# EAGLE design caretaker-switch8 (EAGLE 6.5.0)

## Sheet 1 of 2
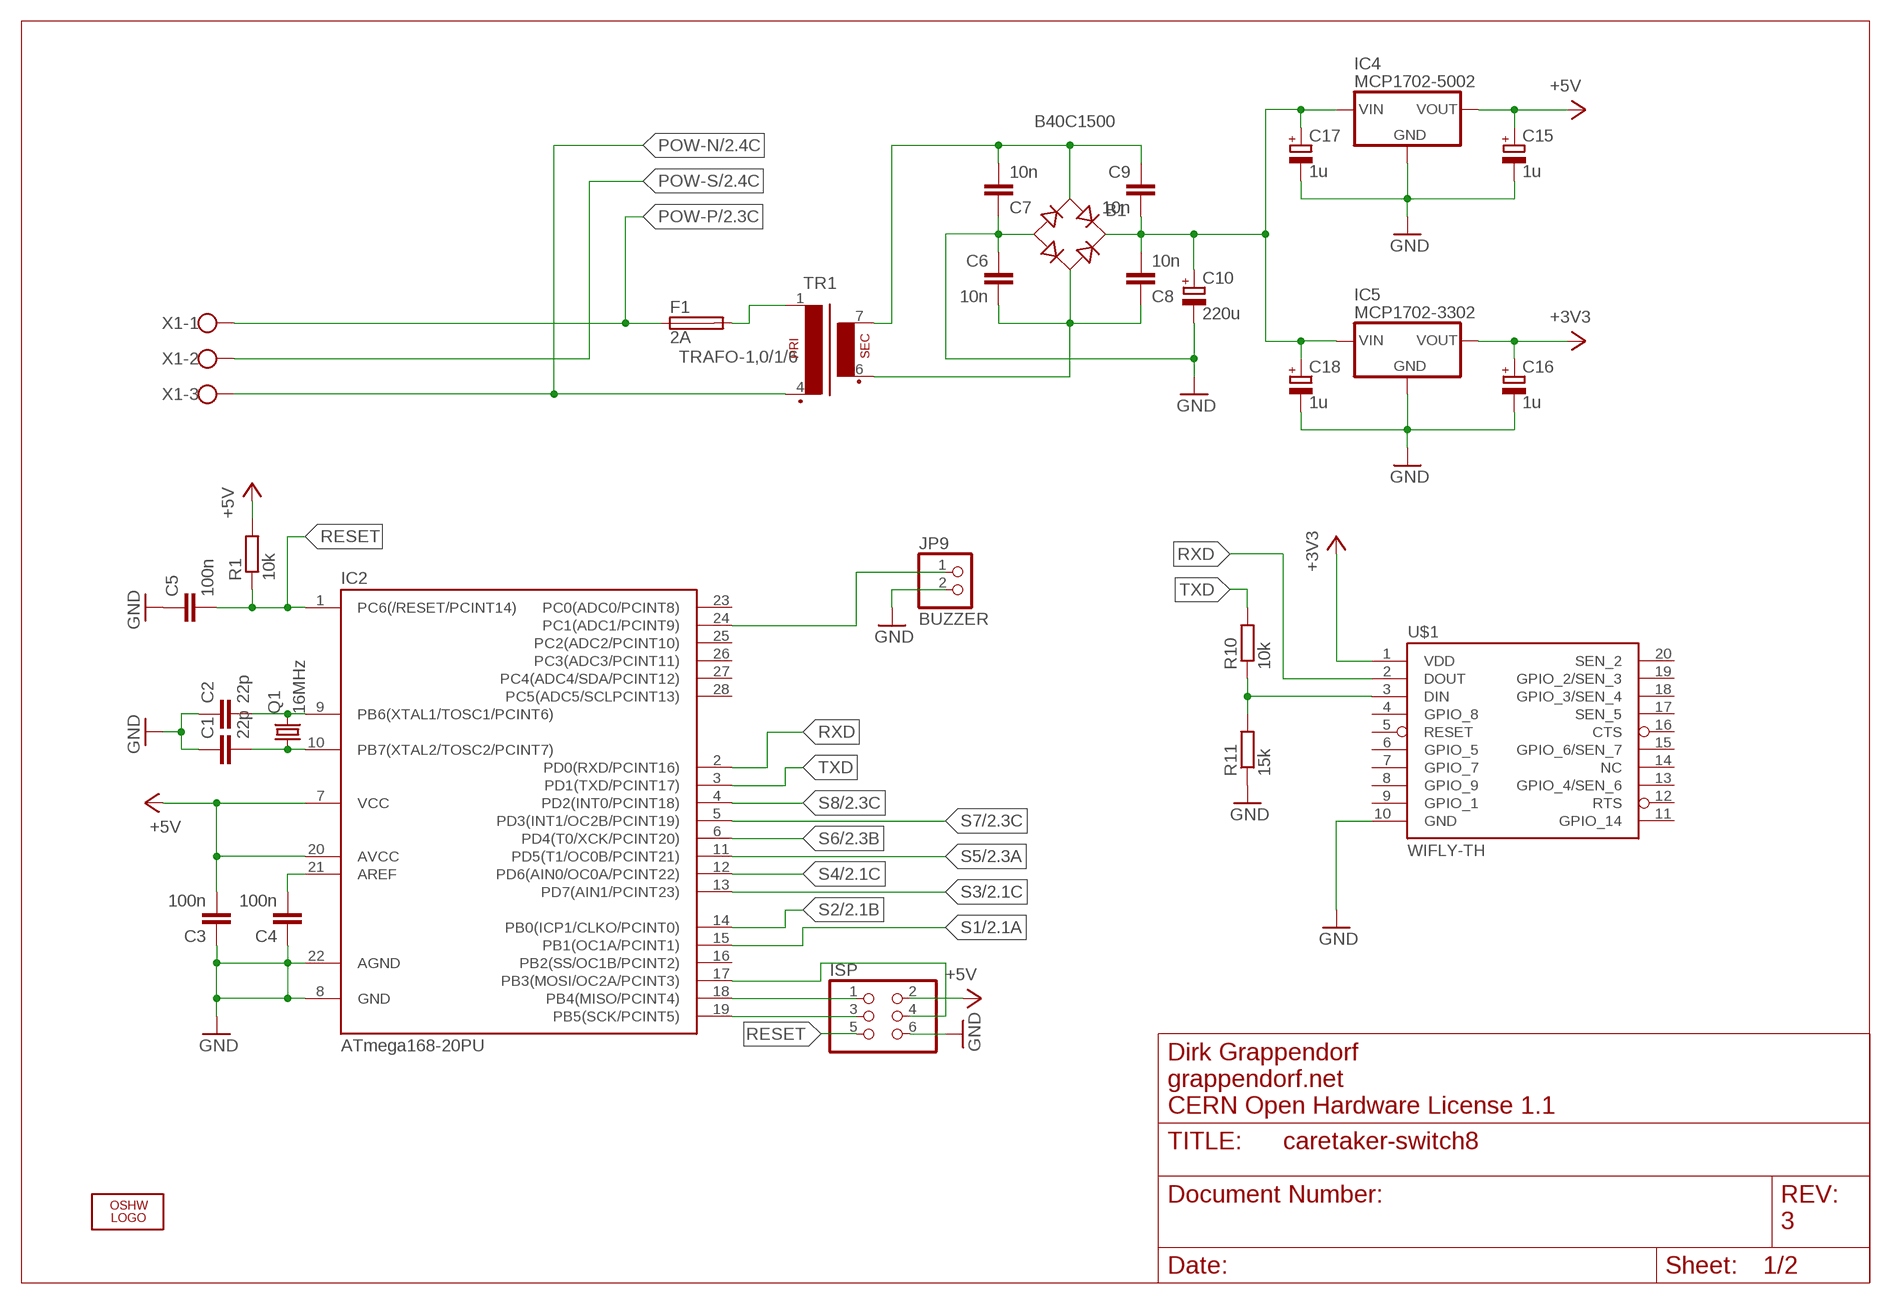
[diagram p0: schematic, sheet 1]

### Parts
B1  B40C1500  RECTIFIER-2KBB  [2KBB]
C1  22p  C-EU025-025X050  [C025-025X050]
C2  22p  C-EU025-025X050  [C025-025X050]
C3  100n  C-EU025-024X044  [C025-024X044]
C4  100n  C-EU025-024X044  [C025-024X044]
C5  100n  C-EU025-024X044  [C025-024X044]
C6  10n  C-EU025-024X044  [C025-024X044]
C7  10n  C-EU025-024X044  [C025-024X044]
C8  10n  C-EU025-024X044  [C025-024X044]
C9  10n  C-EU025-024X044  [C025-024X044]
C10  220u  CPOL-EUE3.5-8  [E3,5-8]
C15  1u  CPOL-EUE2.5-5  [E2,5-5]
C16  1u  CPOL-EUE2.5-5  [E2,5-5]
C17  1u  CPOL-EUE2.5-5  [E2,5-5]
C18  1u  CPOL-EUE2.5-5  [E2,5-5]
F1  2A  SH22,5  [SH22,5]
IC2  ATmega168-20PU  ATMEGA48/88/168-PU  [DIL28-3]
IC4  MCP1702-5002  MCP1702  [MCP1702]
IC5  MCP1702-3302  MCP1702  [MCP1702]
ISP  PINHD-2X3  [2X03]
JP9  BUZZER  PINHD-1X2  [1X02]
LOGO1  OSHW_LOGO_10MILX0350-NT-BOTTOM  [OSHW_10X350_NOTEXT_BOTTOM]
Q1  16MHz  CRYSTALHC49U-V  [HC49U-V]
R1  10k  R-EU_0204/7  [0204/7]
R10  10k  R-EU_0204/7  [0204/7]
R11  15k  R-EU_0204/7  [0204/7]
TR1  TRAFO-1,0/1/6  [TRAFO-1,0/1/6]
U$1  WIFLY-TH  [WIFLY-TH]
X1  W237-103  [W237-103]

### Nets
+3V3: C16.+ IC5.VOUT(OUT) U$1.1(VDD)
+5V: C3.2 C15.+ IC2.7(VCC) IC2.20(AVCC) IC4.VOUT(OUT) ISP.2 R1.2
GND: B1.- C1.1 C2.1 C3.1 C4.1 C5.1 C6.1 C7.1 C10.- C15.- C16.- C17.- C18.- IC2.8(GND) IC2.22(AGND) IC4.GND IC5.GND ISP.6 JP9.2 R11.1 U$1.10(GND) ; also sheet 2
N$1: C2.2 IC2.9(PB6(XTAL1/TOSC1/PCINT6)) Q1.2
N$2: C1.2 IC2.10(PB7(XTAL2/TOSC2/PCINT7)) Q1.1
N$3: C4.2 IC2.21(AREF)
N$4: IC2.18(PB4(MISO/PCINT4)) ISP.1
N$5: IC2.24(PC1(ADC1/PCINT9)) JP9.1
N$6: IC2.19(PB5(SCK/PCINT5)) ISP.3
N$12: B1.AC1 C7.2 C9.1 TR1.7(S4)
N$14: B1.+ C8.2 C9.2 C10.+ C17.+ C18.+ IC4.VIN(IN) IC5.VIN(IN)
N$22: IC2.17(PB3(MOSI/OC2A/PCINT3)) ISP.4
N$42: F1.2 TR1.1
N$49: R10.1 R11.2 U$1.3(DIN)
N$50: B1.AC2 C6.2 C8.1 TR1.6(S3)
POW-N: TR1.4(P2) X1.3 ; also sheet 2
POW-P: F1.1 X1.1 ; also sheet 2
POW-S: X1.2 ; also sheet 2
RESET: C5.2 IC2.1(PC6(/RESET/PCINT14)) ISP.5 R1.1
RXD: IC2.2(PD0(RXD/PCINT16)) U$1.2(DOUT)
S1: IC2.15(PB1(OC1A/PCINT1)) ; also sheet 2
S2: IC2.14(PB0(ICP1/CLKO/PCINT0)) ; also sheet 2
S3: IC2.13(PD7(AIN1/PCINT23)) ; also sheet 2
S4: IC2.12(PD6(AIN0/OC0A/PCINT22)) ; also sheet 2
S5: IC2.11(PD5(T1/OC0B/PCINT21)) ; also sheet 2
S6: IC2.6(PD4(T0/XCK/PCINT20)) ; also sheet 2
S7: IC2.5(PD3(INT1/OC2B/PCINT19)) ; also sheet 2
S8: IC2.4(PD2(INT0/PCINT18)) ; also sheet 2
TXD: IC2.3(PD1(TXD/PCINT17)) R10.2
Unconnected: IC2.16(PB2(SS/OC1B/PCINT2)) IC2.23(PC0(ADC0/PCINT8)) IC2.25(PC2(ADC2/PCINT10)) IC2.26(PC3(ADC3/PCINT11)) IC2.27(PC4(ADC4/SDA/PCINT12)) IC2.28(PC5(ADC5/SCLPCINT13)) U$1.4(GPIO_8) U$1.5(RESET) U$1.6(GPIO_5) U$1.7(GPIO_7) U$1.8(GPIO_9) U$1.9(GPIO_1) U$1.11(GPIO_14) U$1.12(RTS) U$1.13(GPIO_4/SEN_6) U$1.14(NC) U$1.15(GPIO_6/SEN_7) U$1.16(CTS) U$1.17(SEN_5) U$1.18(GPIO_3/SEN_4) U$1.19(GPIO_2/SEN_3) U$1.20(SEN_2)

### Notes on the sheet
- Dirk Grappendorf
- grappendorf.net
- CERN Open Hardware License 1.1
- 3

## Sheet 2 of 2
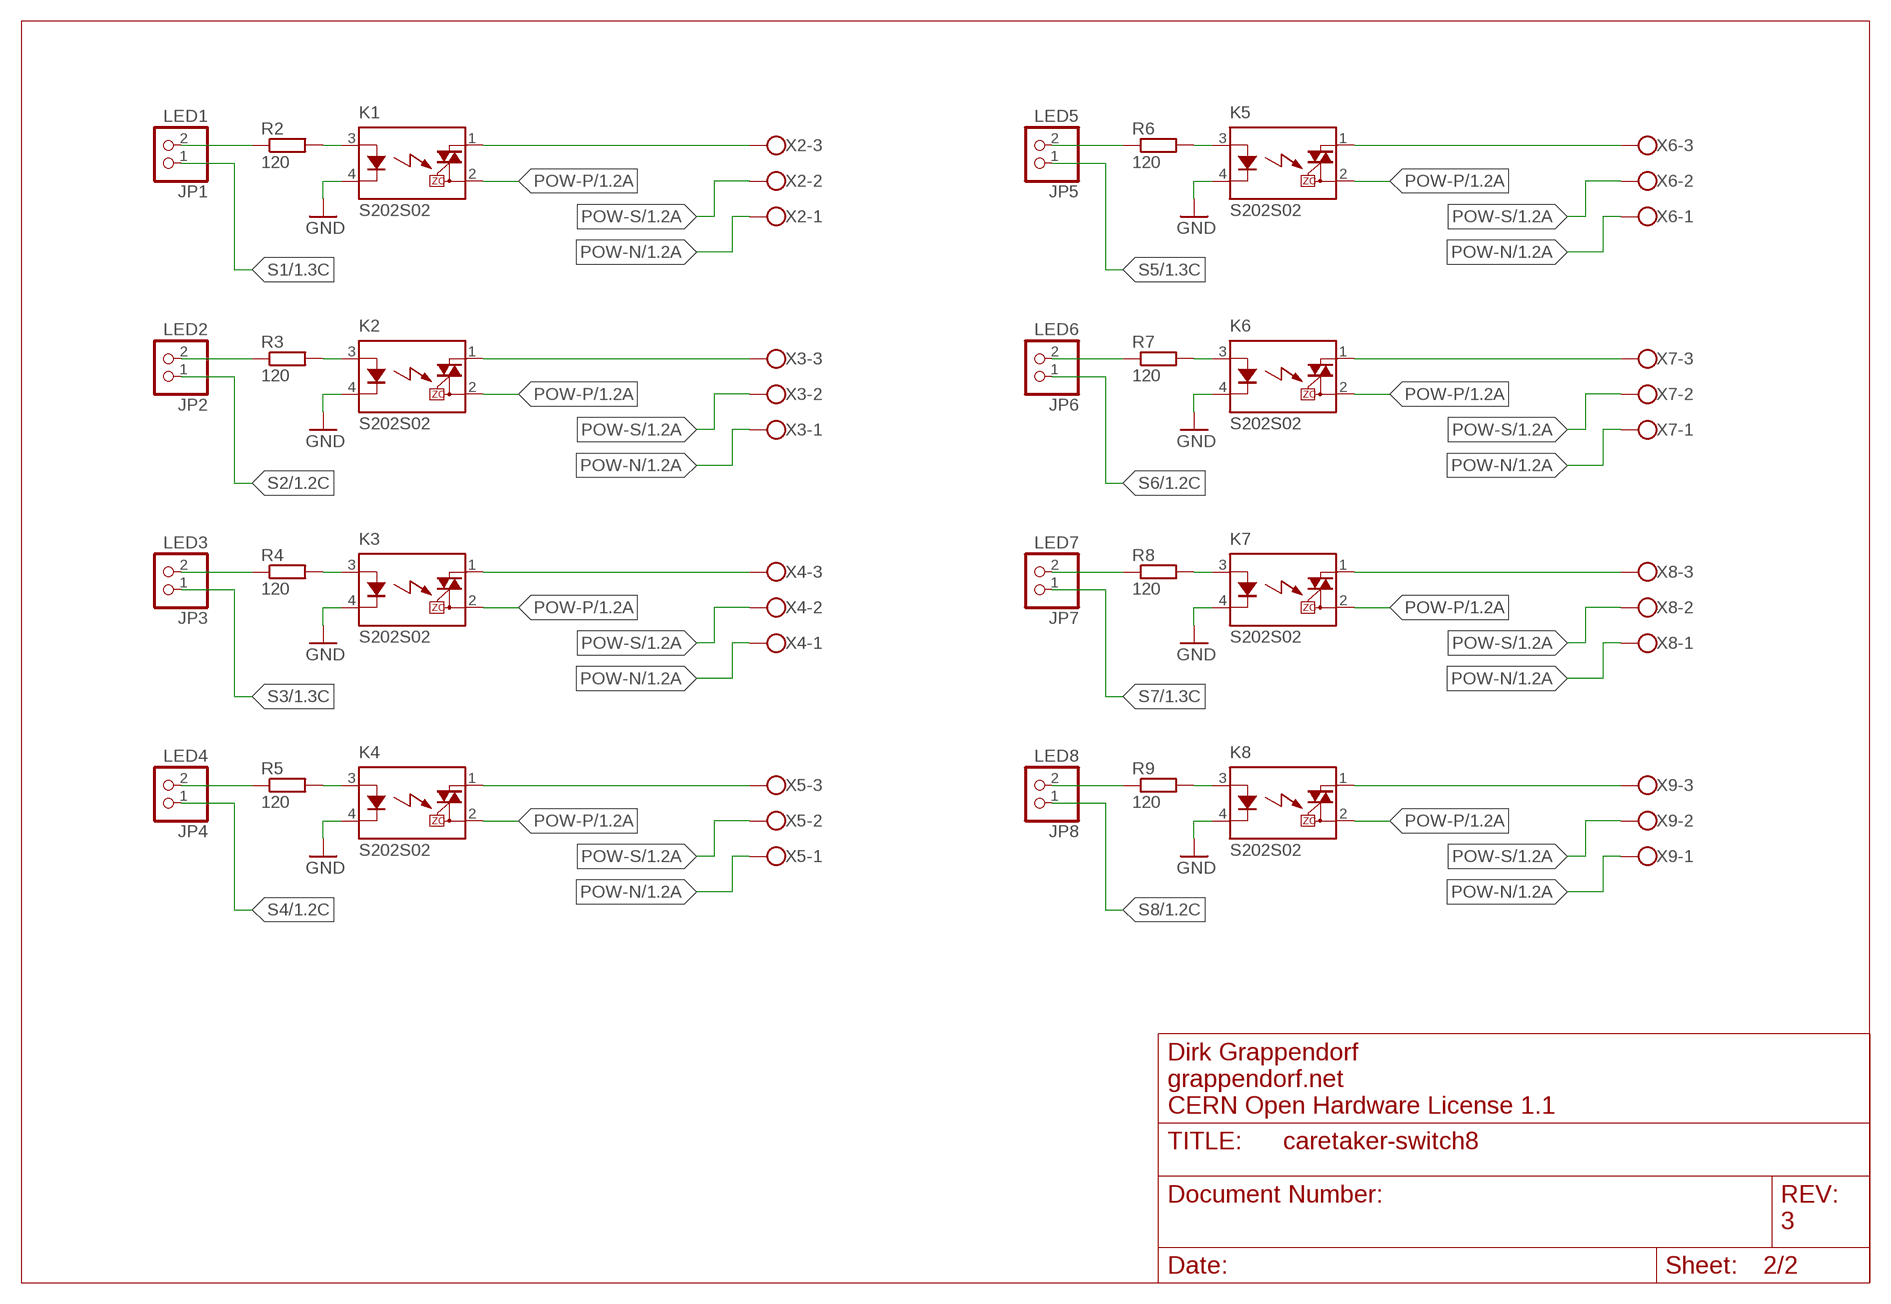
[diagram p1: schematic, sheet 2]

### Parts
JP1  LED1  PINHD-1X2  [1X02]
JP2  LED2  PINHD-1X2  [1X02]
JP3  LED3  PINHD-1X2  [1X02]
JP4  LED4  PINHD-1X2  [1X02]
JP5  LED5  PINHD-1X2  [1X02]
JP6  LED6  PINHD-1X2  [1X02]
JP7  LED7  PINHD-1X2  [1X02]
JP8  LED8  PINHD-1X2  [1X02]
K1  S202S02  [S202S02]
K2  S202S02  [S202S02]
K3  S202S02  [S202S02]
K4  S202S02  [S202S02]
K5  S202S02  [S202S02]
K6  S202S02  [S202S02]
K7  S202S02  [S202S02]
K8  S202S02  [S202S02]
R2  120  R-EU_0204/7  [0204/7]
R3  120  R-EU_0204/7  [0204/7]
R4  120  R-EU_0204/7  [0204/7]
R5  120  R-EU_0204/7  [0204/7]
R6  120  R-EU_0204/7  [0204/7]
R7  120  R-EU_0204/7  [0204/7]
R8  120  R-EU_0204/7  [0204/7]
R9  120  R-EU_0204/7  [0204/7]
X2  W237-103  [W237-103]
X3  W237-103  [W237-103]
X4  W237-103  [W237-103]
X5  W237-103  [W237-103]
X6  W237-103  [W237-103]
X7  W237-103  [W237-103]
X8  W237-103  [W237-103]
X9  W237-103  [W237-103]

### Nets
GND: K1.4(K) K2.4(K) K3.4(K) K4.4(K) K5.4(K) K6.4(K) K7.4(K) K8.4(K) ; also sheet 1
N$7: K1.1(DS1) X2.3
N$9: K2.1(DS1) X3.3
N$10: K3.1(DS1) X4.3
N$11: K4.1(DS1) X5.3
N$13: K5.1(DS1) X6.3
N$15: K6.1(DS1) X7.3
N$16: K7.1(DS1) X8.3
N$17: K8.1(DS1) X9.3
N$18: JP1.2 R2.1
N$19: K1.3(A) R2.2
N$20: JP2.2 R3.1
N$21: K2.3(A) R3.2
N$23: JP3.2 R4.1
N$24: K3.3(A) R4.2
N$29: JP4.2 R5.1
N$30: K4.3(A) R5.2
N$31: JP5.2 R6.1
N$32: K5.3(A) R6.2
N$33: JP6.2 R7.1
N$34: K6.3(A) R7.2
N$35: JP7.2 R8.1
N$36: K7.3(A) R8.2
N$37: JP8.2 R9.1
N$38: K8.3(A) R9.2
POW-N: X2.1 X3.1 X4.1 X5.1 X6.1 X7.1 X8.1 X9.1 ; also sheet 1
POW-P: K1.2(DS2) K2.2(DS2) K3.2(DS2) K4.2(DS2) K5.2(DS2) K6.2(DS2) K7.2(DS2) K8.2(DS2) ; also sheet 1
POW-S: X2.2 X3.2 X4.2 X5.2 X6.2 X7.2 X8.2 X9.2 ; also sheet 1
S1: JP1.1 ; also sheet 1
S2: JP2.1 ; also sheet 1
S3: JP3.1 ; also sheet 1
S4: JP4.1 ; also sheet 1
S5: JP5.1 ; also sheet 1
S6: JP6.1 ; also sheet 1
S7: JP7.1 ; also sheet 1
S8: JP8.1 ; also sheet 1

### Notes on the sheet
- Dirk Grappendorf
- grappendorf.net
- CERN Open Hardware License 1.1
- 3

## Library data of the parts
B1 = rectifier:RECTIFIER-: Rectifier
C1-C9 = rcl:C-EU: CAPACITOR, European symbol
C10 C15-C18 = rcl:CPOL-EU: POLARIZED CAPACITOR, European symbol
F1 = fuse:SH22,5: FUSE HOLDER grid 22,5 mm, OGN0031 8201, Schurter (Buerklin)
IC2 = atmega8:ATMEGA48/88/168-PU
IC4 IC5 = grapelabs:MCP1702: VOLTAGE REGULATOR
ISP = pinhead:PINHD-2X3: PIN HEADER
JP1-JP9 = pinhead:PINHD-1X2: PIN HEADER
K1-K8 = relay:S*02S02: IT(rms) 8A, Zero Cross type SIP 4pin Triac output SSR Source: http://sharp-world.com/products/device/lineup/data/pdf/datasheet/s102s02_e.pdf
LOGO1 = OSHW:OSHW_LOGO_10MIL
Q1 = crystal:CRYSTAL: CRYSTAL
R1-R11 = rcl:R-EU_: RESISTOR, European symbol
TR1 = grapelabs:TRAFO-1,0/1/6: TRANSFORMER 1 primary winding, 1 secondary winding BLOCK
U$1 = grapelabs:WIFLY
X1-X9 = con-wago-500:W237-103: WAGO SCREW CLAMP

## Board
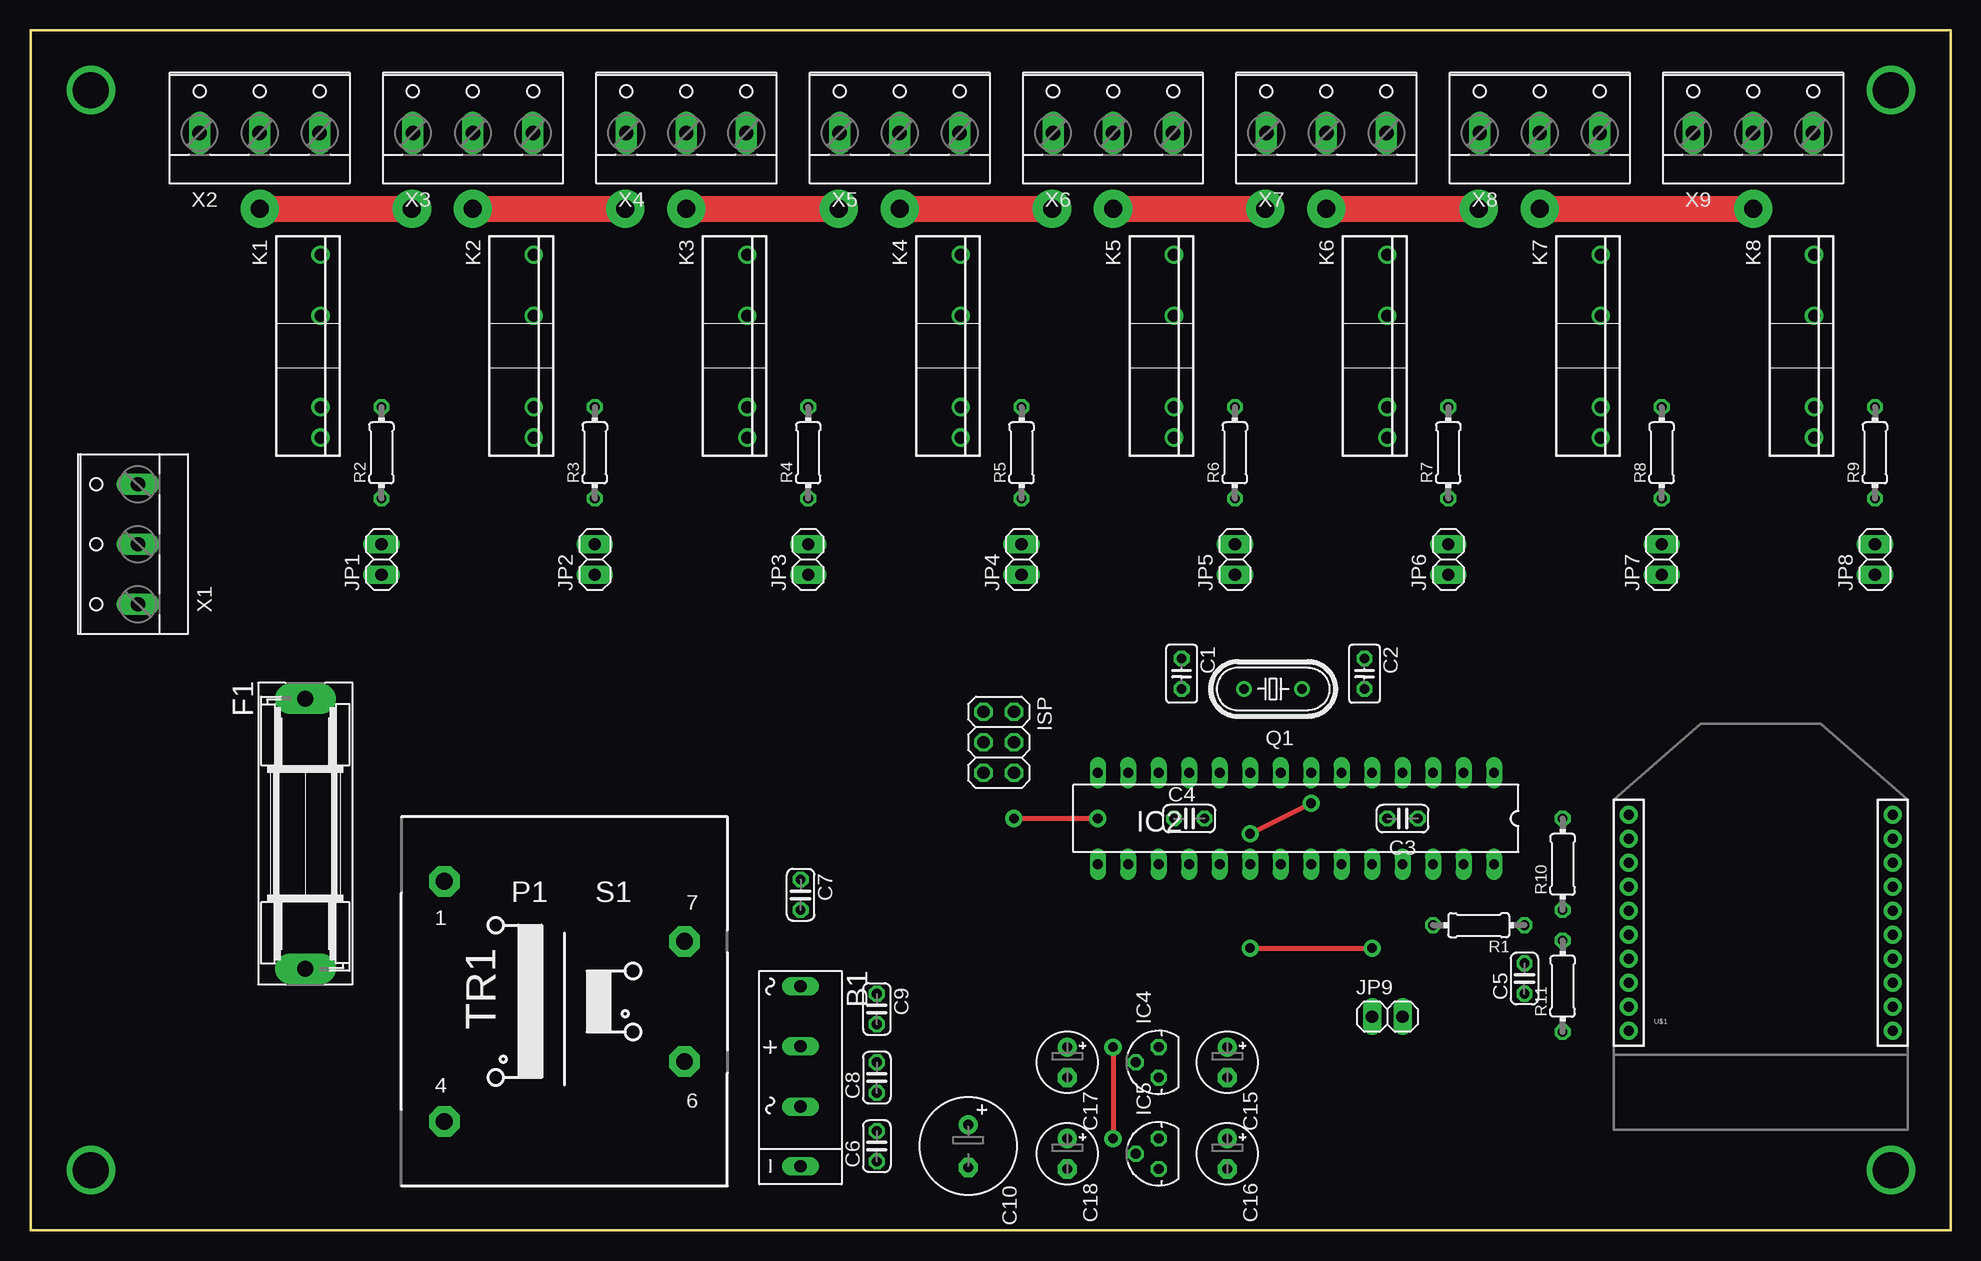
[diagram p2: board, top side]
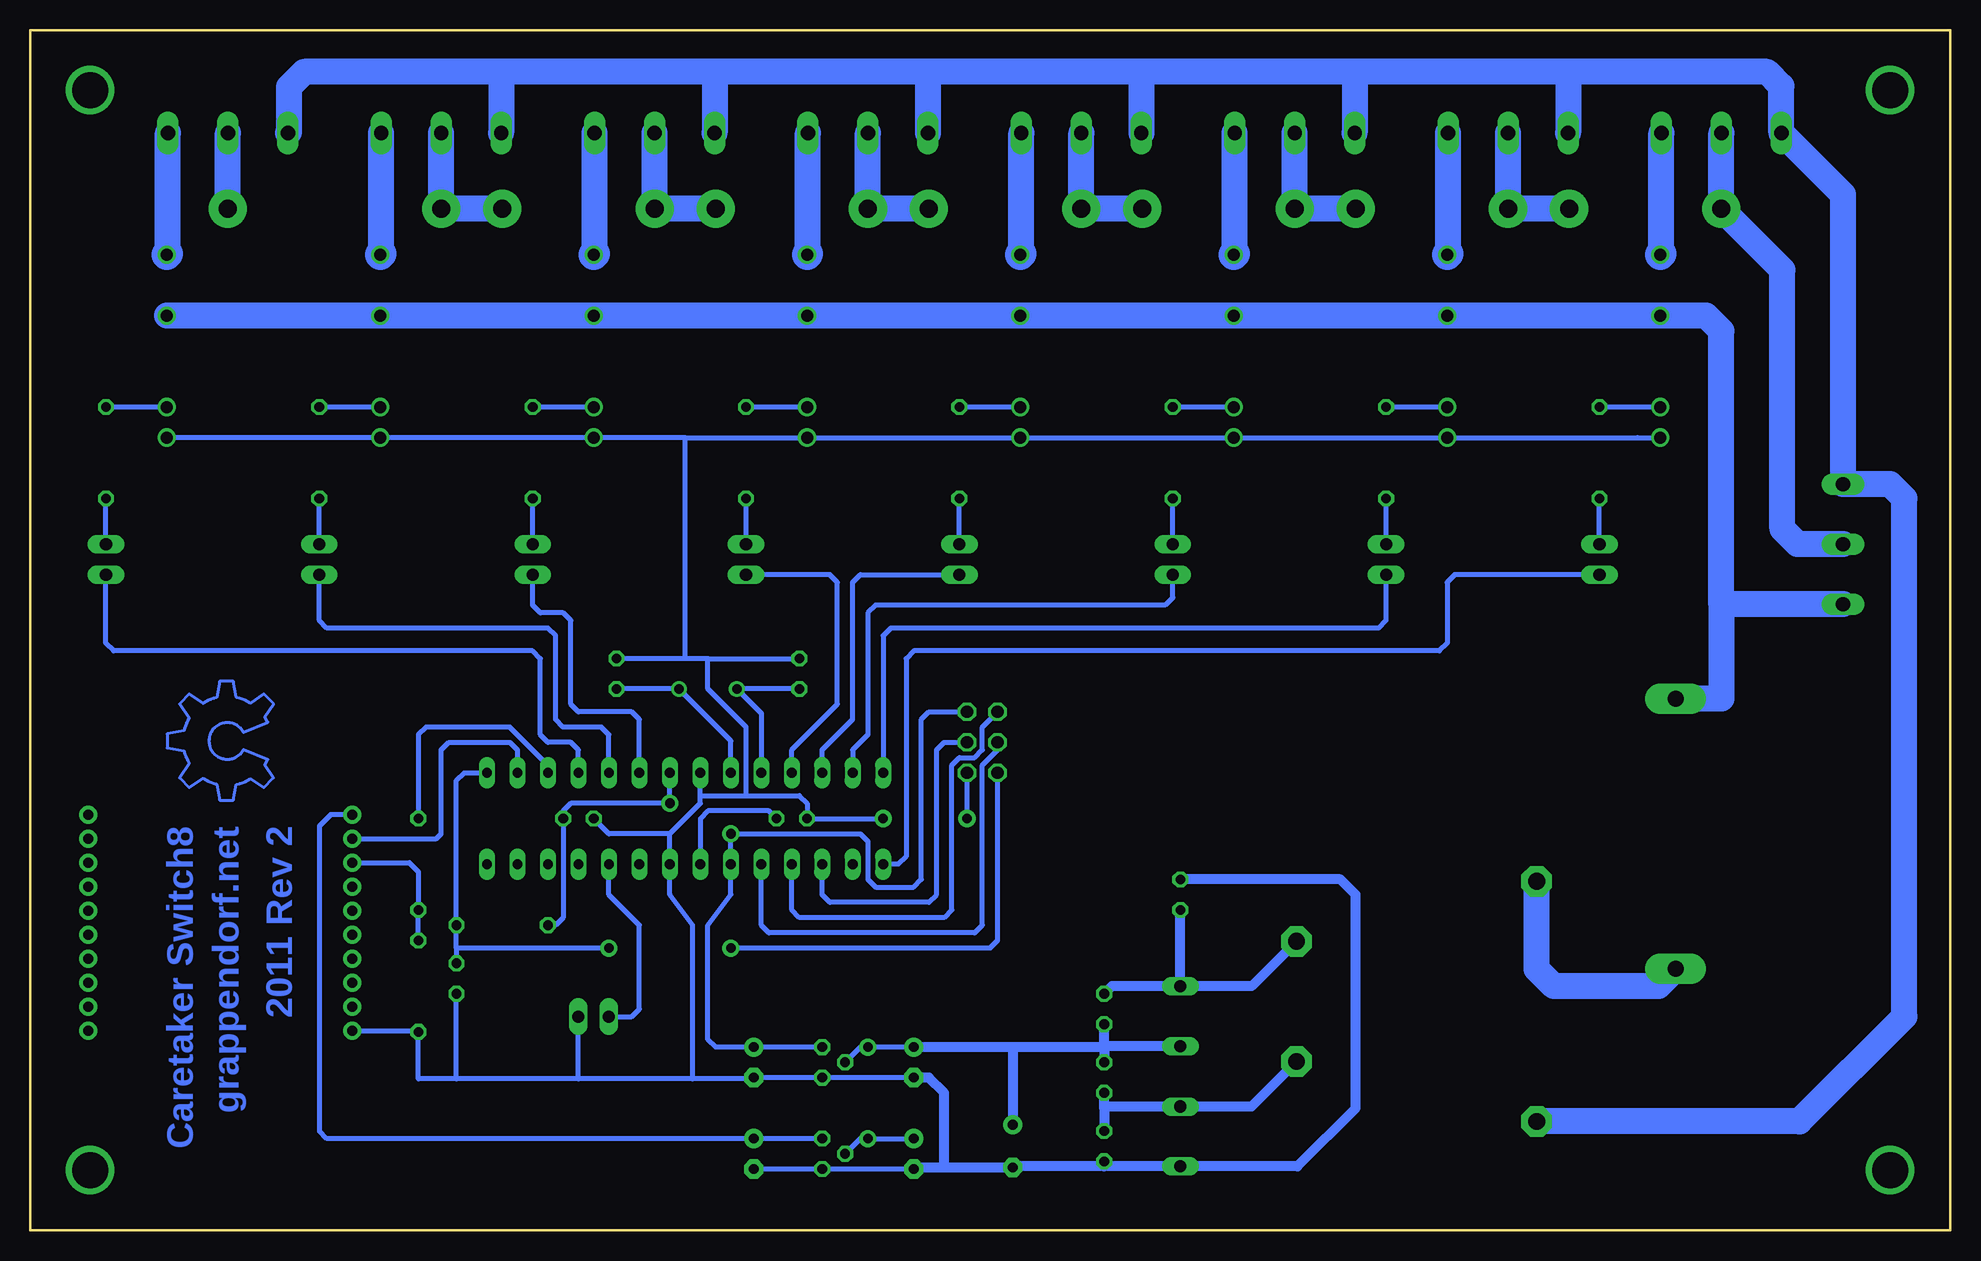
[diagram p3: board, bottom side, seen from below]

Size 160 x 100 mm. Coordinates in mm from the lower left corner, seen from the top.
Outline: 0,0 160,0 160,100 0,100 0,0
Copper layers (1*16): Top 0.035mm / dielectric 1.5mm / Bottom 0.035mm
Design rules "default": minimum track width 10mil, minimum drill 24mil, track to track 8mil, track to pad 8mil, pad to pad 8mil, via to via 8mil, smd to smd 8mil, copper to edge 40mil, drill to drill 8mil, minimum pad ring 10mil, minimum via ring 8mil, stop-mask expansion 4mil, vias tented up to drill 0mil, thermal gap 10mil

### Footprints (pad centres in the part's own frame; a part is rotated, then mirrored left to right if it is on the bottom)
2KBB = drill 1.016 long: + -2.616,0; - 7.391,0; AC1 -7.62,0; AC2 2.413,0
C025-025X050 = drill 0.813 octagon: 1 -1.27,0; 2 1.27,0
C025-024X044 = drill 0.813 octagon: 1 -1.27,0; 2 1.27,0
E3,5-8 = drill 0.813 pad 1.6: + -1.778,0 | drill 0.813 pad 1.6 octagon: - 1.778,0
E2,5-5 = drill 0.813 pad 1.6: + -1.27,0 | drill 0.813 pad 1.6 octagon: - 1.27,0
SH22,5 = drill 1.321 pad 2.54 long: 1 -11.252,0; 2 11.252,0
DIL28-3 = drill 0.813 long: 1 -16.51,-3.81; 2 -13.97,-3.81; 3 -11.43,-3.81; 4 -8.89,-3.81; 5 -6.35,-3.81; 6 -3.81,-3.81; 7 -1.27,-3.81; 8 1.27,-3.81; 9 3.81,-3.81; 10 6.35,-3.81; 11 8.89,-3.81; 12 11.43,-3.81; 13 13.97,-3.81; 14 16.51,-3.81; 15 16.51,3.81; 16 13.97,3.81; 17 11.43,3.81; 18 8.89,3.81; 19 6.35,3.81; 20 3.81,3.81; 21 1.27,3.81; 22 -1.27,3.81; 23 -3.81,3.81; 24 -6.35,3.81; 25 -8.89,3.81; 26 -11.43,3.81; 27 -13.97,3.81; 28 -16.51,3.81
MCP1702 = drill 0.813 octagon: GND -1.27,0; VIN 0,1.905; VOUT 1.27,0
2X03 = drill 1.016 octagon: 1 -2.54,-1.27; 2 -2.54,1.27; 3 0,-1.27; 4 0,1.27; 5 2.54,-1.27; 6 2.54,1.27
1X02 = drill 1.016 long: 1 -1.27,0; 2 1.27,0
S202S02 = drill 1: 1 -7.62,0; 2 -2.54,0; 3 5.08,0; 4 7.62,0
HC49U-V = drill 0.813: 1 -2.413,0; 2 2.413,0
0204/7 = drill 0.813 octagon: 1 -3.81,0; 2 3.81,0
TRAFO-1,0/1/6 = drill 1.397 pad 2.54 octagon: 1 -10.008,10.008; 4 -10.008,-10.008; 6 10.008,-5.004; 7 10.008,5.004
WIFLY-TH = drill 0.8 pad 1.524: 1 -11,20; 2 -11,18; 3 -11,16; 4 -11,14; 5 -11,12; 6 -11,10; 7 -11,8; 8 -11,6; 9 -11,4; 10 -11,2; 11 11,2; 12 11,4; 13 11,6; 14 11,8; 15 11,10; 16 11,12; 17 11,14; 18 11,16; 19 11,18; 20 11,20
W237-103 = drill 1.194 long: 1 -5,-1.29; 2 0,-1.29; 3 5,-1.29

### Placement (x,y rotation side)
B1  64.14,12.7 270 top
C1  95.89,46.35 270 top
C2  111.12,46.35 270 top
C3  114.3,34.29 0 top
C4  96.52,34.29 0 top
C5  124.46,20.95 90 top
C6  70.48,6.99 90 top
C7  64.14,27.94 270 top
C8  70.48,12.7 90 top
C9  70.48,18.41 270 top
C10  78.11,6.99 270 top
C15  99.69,13.97 270 top
C16  99.69,6.35 270 top
C17  86.36,13.97 270 top
C18  86.36,6.35 270 top
F1  22.86,33.02 270 top
IC2  105.41,34.29 180 top
IC4  93.98,13.97 90 top
IC5  93.98,6.35 90 top
ISP  80.64,40.64 270 top
JP1  29.21,55.88 90 top
JP2  46.99,55.88 90 top
JP3  64.77,55.88 90 top
JP4  82.55,55.88 90 top
JP5  100.33,55.88 90 top
JP6  118.11,55.88 90 top
JP7  135.89,55.88 90 top
JP8  153.67,55.88 90 top
JP9  113.03,17.78 0 top
K1  24.13,73.66 270 top
K2  41.91,73.66 270 top
K3  59.69,73.66 270 top
K4  77.47,73.66 270 top
K5  95.25,73.66 270 top
K6  113.03,73.66 270 top
K7  130.81,73.66 270 top
K8  148.59,73.66 270 top
LOGO1  143.51,40.64 270 top
Q1  103.5,45.09 0 top
R1  120.65,25.4 180 top
R2  29.21,64.77 90 top
R3  46.99,64.77 90 top
R4  64.77,64.77 90 top
R5  82.55,64.77 90 top
R6  100.33,64.77 90 top
R7  118.11,64.77 90 top
R8  135.89,64.77 90 top
R9  153.67,64.77 90 top
R10  127.64,30.48 90 top
R11  127.64,20.32 90 top
TR1  44.45,19.05 0 top
U$1  144.15,14.61 0 top
X1  7.62,57.15 90 top
X2  19.05,92.71 0 top
X3  36.83,92.71 0 top
X4  54.61,92.71 0 top
X5  72.39,92.71 0 top
X6  90.17,92.71 0 top
X7  107.95,92.71 0 top
X8  125.73,92.71 0 top
X9  143.51,92.71 0 top

### Tracks (layer width: path | path; a pad name or v marks a point on that pad's centre or on a via)
+3V3
  Bottom 0.406: IC5.VOUT C16.+ 135.25,7.62 135.89,8.26 135.89,33.66 134.94,34.6 U$1.1
+5V  (via drill 0.8 pad 1.42)
  Top 0.406: v101.6,33.02 v106.68,35.56
  Bottom 0.406: IC2.7 v106.68,35.56 114.94,35.56 115.57,34.92 C3.2 115.57,26.04 116.2,25.4 R1.2 | ISP.2 85.09,43.18 85.72,42.55 85.72,29.21 86.36,28.57 89.53,28.57 90.17,29.21 90.17,32.38 90.81,33.02 v101.6,33.02 IC2.20 101.6,27.94 103.5,25.4 103.5,15.88 102.87,15.24 C15.+ IC4.VOUT
GND  (via drill 0.8 pad 1.42)
  Top 0.406: v88.9,34.29 v81.92,34.29
  Bottom 0.406: K1.4 26.04,66.04 K2.4 K3.4 K4.4 K5.4 105.41,66.04 | 105.41,66.04 K6.4 K7.4 K8.4 | 103.5,47.62 C1.1 | 105.41,47.62 C2.1 | 105.41,47.62 105.41,66.04 | 103.5,47.62 105.41,47.62 | 103.5,47.62 103.5,45.09 100.33,41.91 100.33,36.2 | 104.14,36.2 100.33,36.2 | 104.14,36.2 IC2.8 | v88.9,34.29 C4.1 95.25,35.56 95.89,36.2 100.33,36.2 | v81.92,34.29 ISP.6 | C18.- IC5.GND C16.- | C17.- IC4.GND C15.- 99.81,12.59 104.78,12.59 | 104.78,12.59 114.3,12.59 | 114.3,12.59 124.46,12.59 | 124.46,12.59 127.64,12.59 R11.1 127.73,16.61 U$1.10 | 124.46,12.59 C5.1 | 106.68,29.84 106.68,27.94 104.78,25.4 104.78,12.59 | 104.14,36.2 104.14,35.56 106.68,33.02 | IC2.22 106.68,33.02 | 106.68,33.02 111.76,33.02 C3.1 | 114.3,12.59 JP9.2
  Bottom 0.813: 106.68,29.84 IC2.22 | C7.1 50.8,29.21 49.53,27.94 49.53,10.16 54.38,5.31 B1.- 70.48,5.31 | 70.48,5.31 78,5.31 C10.- 83.82,5.21 | 70.48,5.31 C6.1 | 83.82,5.21 86.23,5.21 C18.- | C17.- 85.09,12.7 83.82,11.43 83.82,5.21
N$1
  Bottom 0.406: C2.2 Q1.2 101.6,40.77 IC2.9
N$2
  Bottom 0.406: C1.2 Q1.1 99.06,43.05 IC2.10
N$3
  Bottom 0.406: IC2.21 104.14,34.29 103.5,34.92 98.42,34.92 C4.2
N$4
  Bottom 0.406: IC2.18 96.52,26.67 95.89,26.04 83.82,26.04 83.19,26.67 83.19,38.73 82.55,39.37 81.28,39.37 80.64,40.01 80.64,41.91 ISP.1
N$5
  Bottom 0.406: JP9.1 109.86,17.78 109.22,18.41 109.22,25.4 111.76,27.94 IC2.24
N$6
  Bottom 0.406: ISP.3 79.38,40.01 80.64,38.73 80.64,25.4 81.28,24.77 98.42,24.77 99.06,25.4 IC2.19
N$7
  Bottom 2.184: 24.05,81.36 X2.3
  Bottom 2.54: K1.1 24.05,81.36
N$9
  Bottom 2.184: 41.83,81.36 X3.3
  Bottom 2.54: K2.1 41.83,81.36
N$10
  Bottom 2.184: 59.61,81.36 X4.3
  Bottom 2.54: K3.1 59.61,81.36
N$11
  Bottom 2.184: 77.39,81.36 X5.3
  Bottom 2.54: K4.1 77.39,81.36
N$12
  Bottom 0.813: B1.AC1 58.19,20.32 TR1.7 | B1.AC1 C7.2 | B1.AC1 69.85,20.32 C9.1
N$13
  Bottom 2.184: 95.17,81.36 X6.3
  Bottom 2.54: K5.1 95.17,81.36
N$14  (via drill 0.8 pad 1.42)
  Top 0.406: v90.17,15.24 v90.17,7.62
  Bottom 0.406: C17.+ v90.17,15.24 90.81,15.24 IC4.VIN | C18.+ v90.17,7.62 90.81,7.62 IC5.VIN
  Bottom 0.813: 70.48,15.24 C8.2 | 70.48,15.24 C9.2 | B1.+ 70.41,15.32 70.48,15.24 | 70.48,15.24 78.11,15.24 | 78.11,15.24 C17.+ | 78.11,15.24 C10.+
N$15
  Bottom 2.184: 112.95,81.36 X7.3
  Bottom 2.54: K6.1 112.95,81.36
N$16
  Bottom 2.184: 130.73,81.36 X8.3
  Bottom 2.54: K7.1 130.73,81.36
N$17
  Bottom 2.184: 148.51,81.36 X9.3
  Bottom 2.54: K8.1 148.51,81.36
N$18
  Bottom 0.406: JP1.2 R2.1
N$19
  Bottom 0.406: K1.3 R2.2
N$20
  Bottom 0.406: JP2.2 R3.1
N$21
  Bottom 0.406: K2.3 R3.2
N$22
  Bottom 0.406: IC2.17 93.98,27.94 93.34,27.3 85.09,27.3 84.45,27.94 84.45,40.01 83.82,40.64 ISP.4
N$23
  Bottom 0.406: JP3.2 R4.1
N$24
  Bottom 0.406: K3.3 R4.2
N$25  (via drill 3 pad 2)
  other vias: 5,95
N$26  (via drill 3 pad 2)
  other vias: 155,5
N$27  (via drill 3 pad 2)
  other vias: 5,5
N$28  (via drill 3 pad 2)
  other vias: 155,95
N$29
  Bottom 0.406: JP4.2 R5.1
N$30
  Bottom 0.406: K4.3 R5.2
N$31
  Bottom 0.406: JP5.2 R6.1
N$32
  Bottom 0.406: K5.3 R6.2
N$33
  Bottom 0.406: JP6.2 R7.1
N$34
  Bottom 0.406: K6.3 R7.2
N$35
  Bottom 0.406: JP7.2 R8.1
N$36
  Bottom 0.406: K7.3 R8.2
N$37
  Bottom 0.406: JP8.2 R9.1
N$38
  Bottom 0.406: K8.3 R9.2
N$42
  Bottom 2.184: TR1.1 34.44,21.74 33.02,20.32 24.31,20.32 F1.2
N$43
  Top 0.005: 0.02,-0.05 arc10 0.03,-0.04 | 0.04,-0.03 arc19 0.05,-0.01 | 0.05,0.01 arc19 0.04,0.03 | 0.03,0.04 arc19 0.01,0.05 | -0.03,0.04 arc-19 -0.01,0.05 | -0.05,0.01 arc-19 -0.04,0.03 | -0.04,-0.03 arc-19 -0.05,-0.01 | -0.02,-0.05 arc-10 -0.03,-0.04 | -0.02,0 arc68 -0.01,-0.02 | 0.01,-0.02 arc248 -0.02,0 | 0.02,-0.05 arc10 0.03,-0.04 | 0.03,-0.04 0.05,-0.06 0.06,-0.05 0.04,-0.03 | 0.04,-0.03 arc19 0.05,-0.01 | 0.05,-0.01 0.08,-0.01 0.08,0.01 0.05,0.01 | 0.05,0.01 arc19 0.04,0.03 | 0.04,0.03 0.06,0.05 0.05,0.06 0.03,0.04 | 0.03,0.04 arc19 0.01,0.05 | 0.01,0.05 0.01,0.08 -0.01,0.08 -0.01,0.05 | -0.03,0.04 arc-19 -0.01,0.05 | -0.03,0.04 -0.05,0.06 -0.06,0.05 -0.04,0.03 | -0.05,0.01 arc-19 -0.04,0.03 | -0.05,0.01 -0.08,0.01 -0.08,-0.01 -0.05,-0.01 | -0.04,-0.03 arc-19 -0.05,-0.01 | -0.04,-0.03 -0.06,-0.05 -0.05,-0.06 -0.03,-0.04 | -0.02,-0.05 arc-10 -0.03,-0.04 | -0.01,-0.02 -0.02,-0.05 | -0.02,0 arc68 -0.01,-0.02 | 0.01,-0.02 arc248 -0.02,0 | 0.02,-0.05 0.01,-0.02
N$45  (via drill 1 pad 1.27)
  other vias: 5,95
N$46  (via drill 1 pad 1.27)
  other vias: 155,95
N$47  (via drill 1 pad 1.27)
  other vias: 5,5
N$48  (via drill 1 pad 1.27)
  other vias: 155,5
N$49
  Bottom 0.406: R11.2 R10.1 127.64,29.84 128.4,30.61 U$1.3
N$50
  Bottom 0.813: TR1.6 58.22,10.29 B1.AC2 70.36,10.29 70.48,10.16 | 70.48,10.16 C6.2 | 70.48,10.16 C8.1
POW-N
  Bottom 2.184: 31.75,96.52 15.24,96.52 14.05,95.33 X2.1 8.91,86.28 X1.3 5,62.15 3.81,60.96 3.81,17.78 12.55,9.04 TR1.4 | 31.75,96.52 49.53,96.52 | 49.53,96.52 67.31,96.52 | 67.31,96.52 85.09,96.52 | 85.09,96.52 102.87,96.52 | 102.87,96.52 120.65,96.52 | 120.65,96.52 137.16,96.52 138.43,95.25 138.43,91.5 X9.1 | X3.1 31.83,96.44 31.75,96.52 | X4.1 49.61,96.44 49.53,96.52 | X5.1 67.39,96.44 67.31,96.52 | X6.1 85.17,96.44 85.09,96.52 | X7.1 102.95,96.44 102.87,96.52 | X8.1 120.73,96.44 120.65,96.52
POW-P
  Bottom 2.184: K8.2 K7.2 K6.2 K5.2 K4.2 K3.2 K2.2 K1.2 20.32,76.2 19.05,74.93 19.05,52.07 | F1.1 19.05,44.27 19.05,52.07 | X1.1 18.97,52.15 19.05,52.07
POW-S  (via drill 1.5 pad 3.17)
  Top 2.184: v19.05,85.09 v31.75,85.09 | v36.83,85.09 v49.53,85.09 | v54.61,85.09 v67.31,85.09 | v72.39,85.09 v85.09,85.09 | v90.17,85.09 v102.87,85.09 | v107.95,85.09 v120.65,85.09 | v125.73,85.09 v143.51,85.09
  Bottom 2.184: v143.51,85.09 X9.2 | X8.2 v125.73,85.09 v120.65,85.09 | X7.2 v107.95,85.09 v102.87,85.09 | X6.2 v90.17,85.09 v85.09,85.09 | X5.2 v72.39,85.09 v67.31,85.09 | X4.2 v54.61,85.09 v49.53,85.09 | X3.2 v36.83,85.09 v31.75,85.09 | X2.2 v19.05,85.09 13.97,80.01 13.97,58.42 12.7,57.15 X1.2
RESET  (via drill 0.8 pad 1.42)
  Top 0.406: v101.6,23.5 v111.76,23.5
  Bottom 0.406: IC2.1 123.83,38.1 124.46,37.47 R1.1 124.46,23.5 | 124.46,23.5 C5.2 | ISP.5 79.38,24.13 80.01,23.5 v101.6,23.5 | v111.76,23.5 124.46,23.5
RXD
  Bottom 0.406: IC2.2 119.38,40.01 120.02,40.64 125.09,40.64 125.73,40.01 125.73,33.02 126.14,32.6 U$1.2
S1
  Bottom 0.406: JP1.1 41.27,54.61 41.91,53.98 41.91,48.9 42.55,48.26 86.36,48.26 87,47.62 87,31.11 87.63,30.48 IC2.15
S2
  Bottom 0.406: JP2.1 46.99,50.8 47.62,50.16 88.27,50.16 88.9,49.53 IC2.14
S3
  Bottom 0.406: JP3.1 64.77,52.7 65.41,52.07 89.53,52.07 90.17,51.44 90.17,41.27 91.44,40.01 IC2.13
S4
  Bottom 0.406: IC2.12 93.98,40.01 91.44,42.55 91.44,53.98 90.81,54.61 JP4.1
S5
  Bottom 0.406: IC2.11 96.52,40.01 92.71,43.81 92.71,53.98 93.34,54.61 JP5.1
S6
  Bottom 0.406: JP6.1 118.11,52.07 117.47,51.44 115.57,51.44 114.94,50.8 114.94,43.81 114.3,43.18 109.86,43.18 109.22,42.55 IC2.6
S7
  Bottom 0.406: JP7.1 135.89,50.8 135.25,50.16 116.84,50.16 116.2,49.53 116.2,42.55 115.57,41.91 112.39,41.91 111.76,41.27 IC2.5
S8
  Bottom 0.406: JP8.1 153.67,48.9 153.03,48.26 118.11,48.26 117.47,47.62 117.47,41.27 116.84,40.64 114.94,40.64 114.3,40.01 IC2.4
TXD
  Bottom 0.406: IC2.3 116.84,38.73 120.02,41.91 127,41.91 127.64,41.27 R10.2

### Text on the board
Bottom: 2011 Rev 2 | grappendorf.net | Caretaker Switch8